# Altium project MultiStage_Cascade_SOT343.PrjPcb
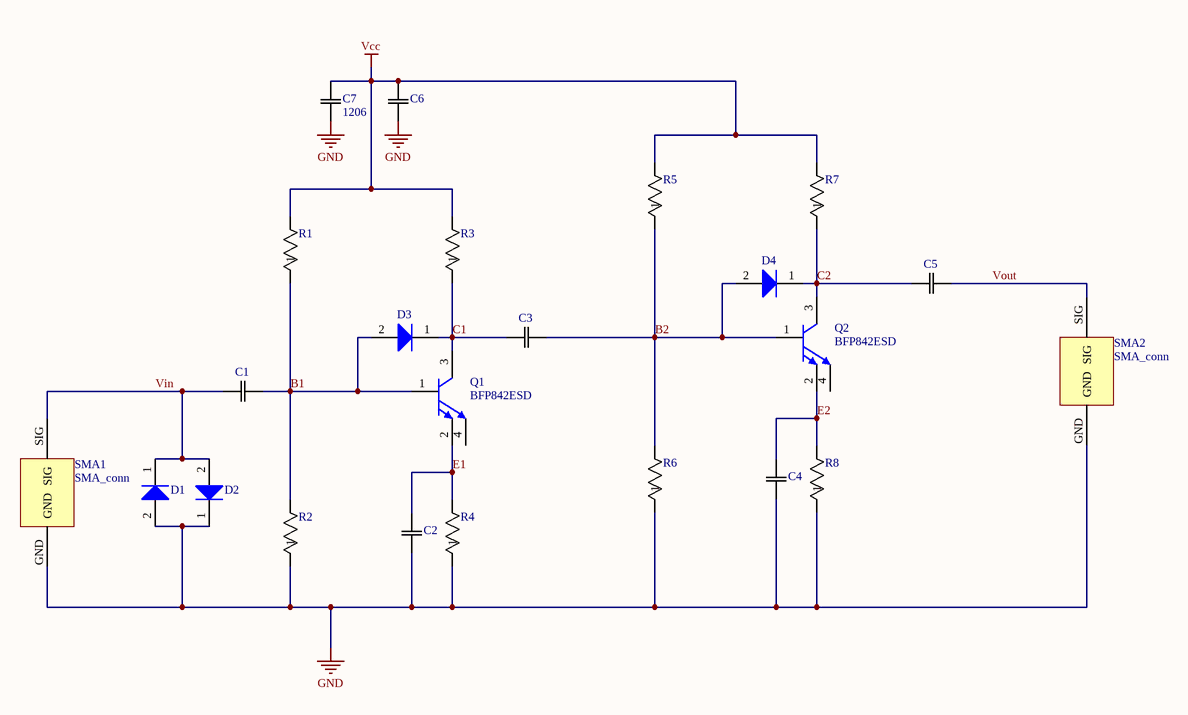
[diagram p0: MultiStage_Cascade_SOT343.SchDoc]
1 sheet, 23 parts. Net scope: global (net labels, ports and power ports of the same name join across sheets).
Board file: MultiStage_Cascade_SOT343.PcbDoc

## Sheet MultiStage_Cascade_SOT343.SchDoc
size A4

### Parts
C1  (no value)  [CAP_K1]
C2  (no value)  [CAP_K1]
C3  (no value)  [CAP_K1]
C4  (no value)  [CAP_K1]
C5  (no value)  [CAP_K1]
C6  (no value)  [CAP_K1]
C7  1206  [C1206C]
D1  (no value)  [INF-SOD323_V]
D2  (no value)  [INF-SOD323_V]
D3  (no value)  [INF-SOD323_V]
D4  (no value)  [INF-SOD323_V]
Q1  BFP842ESD  [INF-SOT343_V]
Q2  BFP842ESD  [INF-SOT343_V]
R1  (no value)  [RES_RC0201_P6XP3]
R2  (no value)  [RES_RC0201_P6XP3]
R3  (no value)  [RES_RC0201_P6XP3]
R4  (no value)  [RES_RC0201_P6XP3]
R5  (no value)  [RES_RC0201_P6XP3]
R6  (no value)  [RES_RC0201_P6XP3]
R7  (no value)  [RES_RC0201_P6XP3]
R8  (no value)  [RES_RC0201_P6XP3]
SMA1  SMA_conn  [SMA_conn]
SMA2  SMA_conn  [SMA_conn]

### Nets
GND: C2.1 C4.1 C6.1 C7.1 D1.2(A) D2.1(K) R2.1 R4.1 R6.1 R8.1 SMA1.GND SMA2.GND
Vcc: C6.2 C7.2 R1.2 R3.2 R5.2 R7.2
B1: C1.2 D3.2(A) Q1.1(B) R1.1 R2.2
B2: C3.1 D4.2(A) Q2.1(B) R5.1 R6.2
C1: C3.2 D3.1(K) Q1.3(C) R3.1
C2: C5.2 D4.1(K) Q2.3(C) R7.1
E1: C2.2 Q1.2(E) R4.2
E2: C4.2 Q2.2(E) R8.2
Vin: C1.1 D1.1(K) D2.2(A) SMA1.SIG
Vout: C5.1 SMA2.SIG

Not connected (* = marked no-connect by the designer): Q1 4(E); Q2 4(E)

### Library data of the parts
C1-C6 = ECH-U1C182GX5: No Description Available; Vendor: Panasonic; Built_By: EMA_UL_Team; Type: DEV; Manufacturer_Part_Number: ECH-U1C182GX5; Copyright: Copyright (C) 2018 Accelerated Designs. All rights reserved; RefDes: RefDes; Value: Value
C7 = C1206C221KDGACTU: No Description Available; Vendor: Kemet; Built_By: EMA_UL_Team; Type: DEV; Manufacturer_Part_Number: C1206C221KDGACTU; Copyright: Copyright (C) 2018 Accelerated Designs. All rights reserved; RefDes: RefDes; Value: Value
D1-D4 = BAT15-03W: Single Silicon Schottky Diode, 110 mA IF Max, SOD32, Green; Manufacturer: Infineon; CT (typ): 0.26 pF; Green: yes; Group: RF Mixer; IF (max): 110 mA; VF (typ): 0.23 V; VR (max): 4 V; DatasheetVersion: Jun-2011; PackageReference: SOD323; PackageDescription: 2-Pin Small Outline Diode Package, 1.25 x 1.7 mm Body; Supplier 1: Mouser; Supplier Part Number 1: N/A; Configuration: Single; Mounting Technology: Surface Mount; PartNumber: BAT15-03W; ComponentLink1Description: Manufacturer URL; ComponentLink1URL: http://www.infineon.com/; ComponentLink2Description: Datasheet; ComponentLink2URL: http://www.infineon.com/dgdl/bat15series.pdf?folderId=db3a304314dca3890114ff6812070b44&fileId=db3a304314dca3890114ff6b74ca0b48&location=en.Products.RF.RF_Mixer___Detector_Schottky_Diodes.DATASHEET.bat15series.pdf; ComponentLink3Description: Package Specification; ComponentLink3URL: http://www.infineon.com/dgdl/SOD323-Package_Overview.pdf?folderId=db3a30431936bc4b011952aab84f3bbe&fileId=db3a30431936bc4b011952beed653be3
Q1 Q2 = BFP842ESD: Robust Low Noise Silicon Germanium Bipolar RF Transistor, 3.25 V VCEO, 40 mA IC, 33 dB Gmax, SOT343, Green; Manufacturer: Infineon; Gmax (typ): 33 dB; Green: yes; Group: Robust ultra low noise SiGe; IC (max): 40 mA; NFmin (typ): 0.4 dB; Ptot (max): 120.0 mW; VCEO (max): 3.25 V; DatasheetVersion: Rev. 1.0; PackageReference: SOT343; PackageDescription: 4-Pin Small Outline Transistor Package, 1.25 x 2 mm Body; Halogen-free: yes; Mounting Technology: Surface Mount; PartNumber: BFP842ESD; ComponentLink1Description: Manufacturer URL; ComponentLink1URL: http://www.infineon.com/; ComponentLink2Description: Datasheet; ComponentLink2URL: http://www.infineon.com/dgdl/Infineon_Robust_WiFi_SiGe_BFP842ESD_Rev1_0.pdf?folderId=db3a30431f848401011fcbf2ab4c04c4&fileId=db3a3043394427e401394df03a3a27c9&location=en.Products.RF.RF_Transistors_.Ultra_Low_Noise_SiGe_C_Transistors_for_use_up_to_12_GHz.DATASHEET.Infineon_Robust_WiFi_SiGe_BFP842ESD_Rev1_0.pdf; ComponentLink3Description: Package Specification; ComponentLink3URL: http://www.infineon.com/dgdl/SOT343-Package_Overview.pdf?folderId=db3a30431936bc4b0119535155343cba&fileId=db3a30431936bc4b0119535a9f393cd3
R1-R8 = RC0201FR-0718KL: No Description Available; Vendor: Yageo; Built_By: EMA_Anthony; Copyright: Copyright (C) 2018 Accelerated Designs. All rights reserved; Manufacturer_Part_Number: RC0201FR-0718KL; RefDes: RefDes; Type: DEV; Value: Value